# EAGLE design floppy (EAGLE 8.3.1)
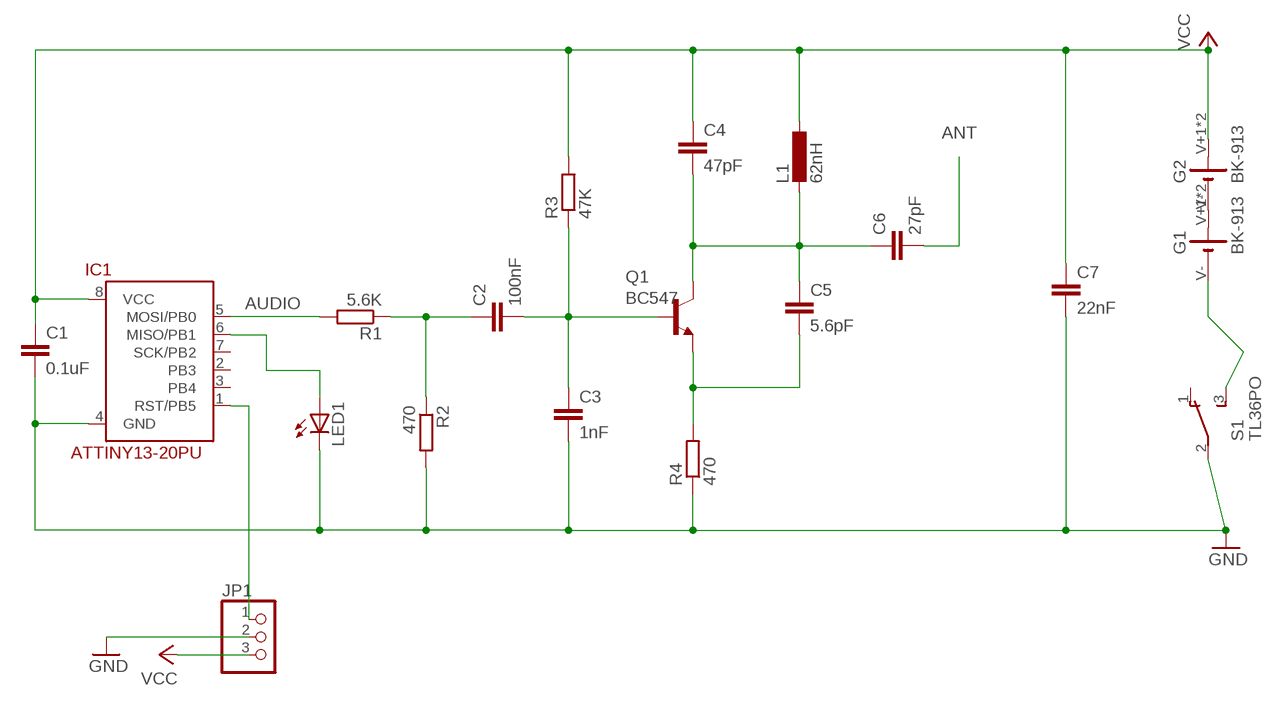
[diagram p0: schematic, sheet 1]

## Parts
C1  0.1uF  C-EU025-025X050  [C025-025X050]
C2  100nF  C-EU025-025X050  [C025-025X050]
C3  1nF  C-EU025-025X050  [C025-025X050]
C4  47pF  C-EU025-025X050  [C025-025X050]
C5  5.6pF  C-EU025-025X050  [C025-025X050]
C6  27pF  C-EU025-025X050  [C025-025X050]
C7  22nF  C-EU025-025X050  [C025-025X050]
G1  BK-913  [BK-913]
G2  BK-913  [BK-913]
IC1  ATTINY13-20PU  [DIL08]
JP1  PINHD-1X3  [1X03]
L1  62nH  L-EU0207/7  [0207/7]
LED1  LED5MM  [LED5MM]
Q1  BC547  [TO92]
R1  5.6K  R-EU_0207/7  [0207/7]
R2  470  R-EU_0207/7  [0207/7]
R3  47K  R-EU_0207/7  [0207/7]
R4  470  R-EU_0207/7  [0207/7]
S1  TL36PO  [TL3XPO]

## Nets
ANT: C6.2
AUDIO: C2.1 R1.1 R2.1
DW: IC1.1(RST/PB5) JP1.1
GND: C1.2 C3.2 C7.2 IC1.4(GND) JP1.2 LED1.K(C) R2.2 R4.1 S1.2(P)
N$3: G1.V- S1.3(S)
N$4: IC1.5(MOSI/PB0) R1.2
N$5: IC1.6(MISO/PB1) LED1.A
N$6: C4.2 C5.1 C6.1 L1.2 Q1.3(C)
N$7: C5.2 Q1.1(E) R4.2
N$8: C2.2 C3.1 Q1.2(B) R3.1
N$9: G1.V+1(V+) G1.V+2(V+) G2.V-
VCC: C1.1 C4.1 C7.1 G2.V+1(V+) G2.V+2(V+) IC1.8(VCC) JP1.3 L1.1 R3.2
Unconnected: IC1.2(PB3) IC1.3(PB4) IC1.7(SCK/PB2) S1.1(O)

## Library data of the parts
C1-C7 = rcl:C-EU: CAPACITOR, European symbol
G1 G2 = local:BK-913: BK-913 CR2032 BATTERY RETAINER
IC1 = attiny13:ATTINY13-20*
JP1 = pinhead:PINHD-1X3: PIN HEADER
L1 = rcl:L-EU: INDUCTOR, European symbol
LED1 = led:LED: LED OSRAM: - CHIPLED LG R971, LG N971, LY N971, LG Q971, LY Q971, LO R971, LY R971 LH N974, LH R974 LS Q976, LO Q976, LY Q976 LO Q996 - Hyper CHIPLED LW Q18S LB Q993, LB Q99A, LB R99A - SideLED LS A670, LO A670, LY A670, LG A670, LP A670 LB A673, LV A673, LT A673, LW A673 LH A674 LY A675 LS A676, LA A676, LO A676, LY A676, LW A676 LS A679, LY A679, LG A679 - Hyper Micro SIDELED® LS Y876, LA Y876, LO Y876, LY Y876 LT Y87S - SmartLED LW L88C, LW L88S LB L89C, LB L89S, LG L890 LS L89K, LO L89K, LY L89K LS L896, LA L896, LO L896, LY L896 - TOPLED LS T670, LO T670, LY T670, LG T670, LP T670 LSG T670, LSP T670, LSY T670, LOP T670, LYG T670 LG T671, LOG T671, LSG T671 LB T673, LV T673, LT T673, LW T673 LH T674 LS T676, LA T676, LO T676, LY T676, LB T676, LH T676, LSB T676, LW T676 LB T67C, LV T67C, LT T67C, LS T67K, LO T67K, LY T67K, LW E67C LS E67B, LA E67B, LO E67B, LY E67B, LB E67C, LV E67C, LT E67C LW T67C LS T679, LY T679, LG T679 LS T770, LO T770, LY T770, LG T770, LP T770 LB T773, LV T773, LT T773, LW T773 LH T774 LS E675, LA E675, LY E675, LS T675 LS T776, LA T776, LO T776, LY T776, LB T776 LHGB T686 LT T68C, LB T68C - Hyper Mini TOPLED® LB M676 - Mini TOPLED Santana® LG M470 LS M47K, LO M47K, LY M47K Source: http://www.osram.convergy.de LUXEON: - LUMILED® LXK2-PW12-R00, LXK2-PW12-S00, LXK2-PW14-U00, LXK2-PW14-V00 LXK2-PM12-R00, LXK2-PM12-S00, LXK2-PM14-U00 LXK2-PE12-Q00, LXK2-PE12-R00, LXK2-PE12-S00, LXK2-PE14-T00, LXK2-PE14-U00 LXK2-PB12-K00, LXK2-PB12-L00, LXK2-PB12-M00, LXK2-PB14-N00, LXK2-PB14-P00, LXK2-PB14-Q00 LXK2-PR12-L00, LXK2-PR12-M00, LXK2-PR14-Q00, LXK2-PR14-R00 LXK2-PD12-Q00, LXK2-PD12-R00, LXK2-PD12-S00 LXK2-PH12-R00, LXK2-PH12-S00 LXK2-PL12-P00, LXK2-PL12-Q00, LXK2-PL12-R00 Source: www.luxeon.com KINGBRIGHT: KA-3528ASYC Source: www.kingbright.com
Q1 = transistor-npn:BC547*: NPN Transistor
R1-R4 = rcl:R-EU_: RESISTOR, European symbol
S1 = switch:TL36PO: TINY SWITCH ON - ON Source: http://www2.produktinfo.conrad.com/datenblaetter/700000-724999/705152-da-01-de-Subminiaturschalter_TL_36YO.pdf

## Board
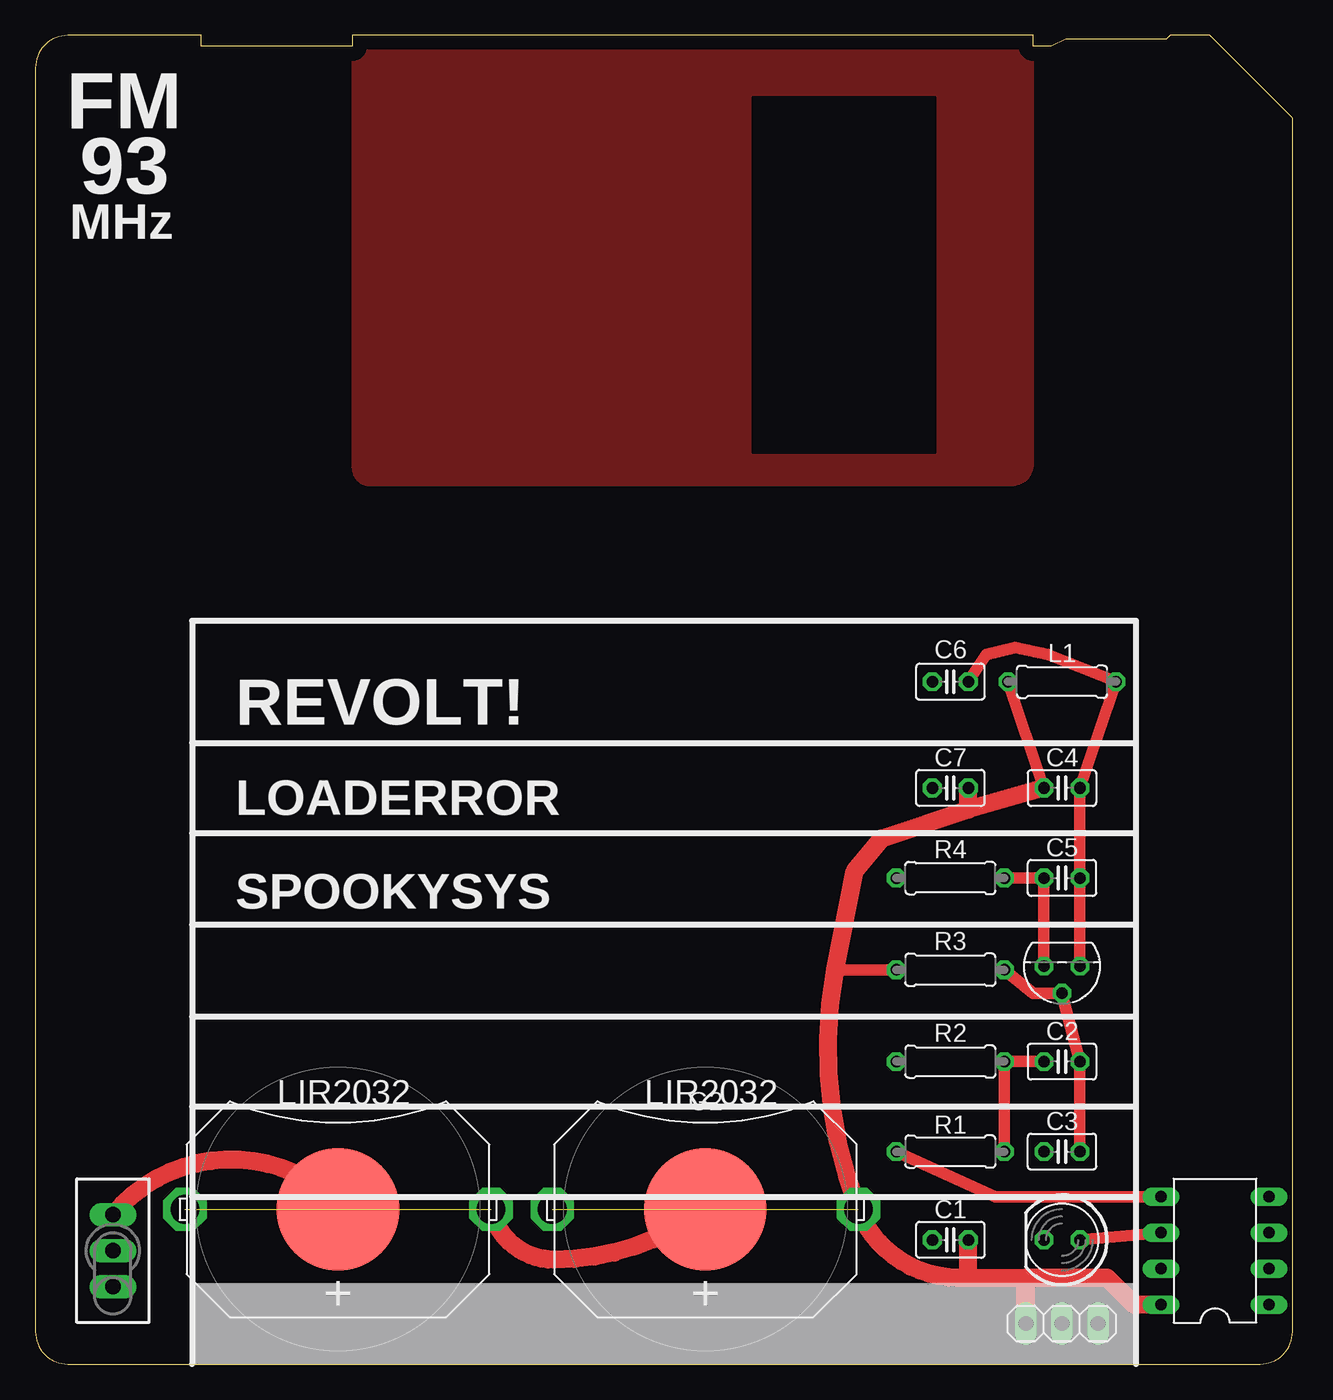
[diagram p1: board, top side]
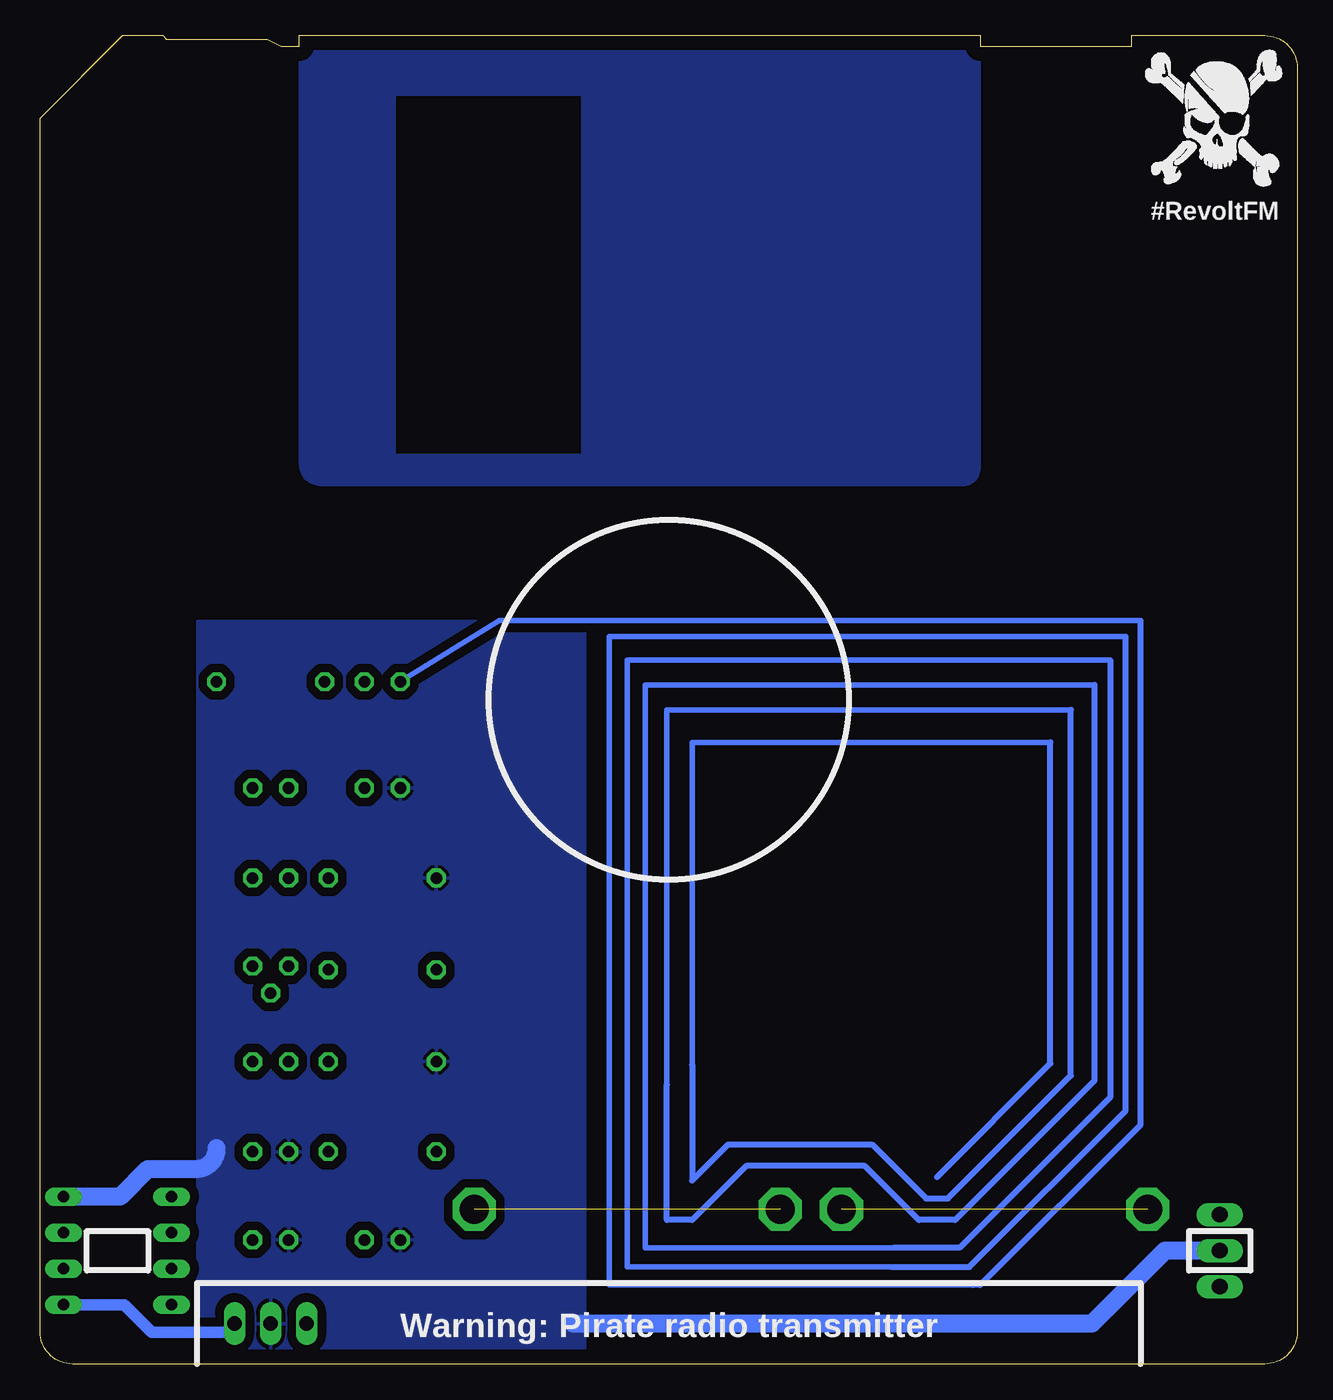
[diagram p2: board, bottom side, seen from below]

Size 88.65 x 93.73 mm. Coordinates in mm from the lower left corner, seen from the top.
Outline: 2.29,0 86.36,0 arc90 88.65,2.29 88.65,87.88 82.8,93.73 80.01,93.73 79.76,93.47 72.64,93.47 71.63,92.96 70.36,92.96 70.36,93.73 22.35,93.73 22.35,92.96 11.68,92.96 11.68,93.73 2.29,93.73 arc90 0,91.44 0,2.29 arc90 2.29,0
Copper layers (1*16): Top 0.035mm / dielectric 1.5mm / Bottom 0.035mm
Design rules "default": minimum track width 6mil, minimum drill 0.35mm, track to track 6mil, track to pad 6mil, pad to pad 6mil, via to via 6mil, smd to smd 6mil, copper to edge 40mil, drill to drill 6mil, minimum pad ring 10mil, minimum via ring 8mil, stop-mask expansion 4mil, vias tented up to drill 0mil, thermal gap 10mil

### Footprints (pad centres in the part's own frame; a part is rotated, then mirrored left to right if it is on the bottom)
C025-025X050 = drill 0.813 octagon: 1 -1.27,0; 2 1.27,0
BK-913 = drill 2.032 octagon: V+1 -10.795,0; V+2 10.795,0 | smd 8.636 x 8.636: V- 0,0
DIL08 = drill 0.813 long: 1 -3.81,-3.81; 2 -1.27,-3.81; 3 1.27,-3.81; 4 3.81,-3.81; 5 3.81,3.81; 6 1.27,3.81; 7 -1.27,3.81; 8 -3.81,3.81
1X03 = drill 1.016 long: 1 -2.54,0; 2 0,0; 3 2.54,0
0207/7 = drill 0.813 octagon: 1 -3.81,0; 2 3.81,0
LED5MM = drill 0.813 octagon: A -1.27,0; K 1.27,0
TO92 = drill 0.813 octagon: 1 1.27,0; 2 0,1.905; 3 -1.27,0
TL3XPO = drill 1.1 pad 1.422 long: 1 -2.54,0; 2 0,0; 3 2.54,0

### Placement (x,y rotation side)
C1  64.52,8.76 180 top
C2  72.39,21.34 0 top
C3  72.39,14.99 180 top
C4  72.39,40.64 0 top
C5  72.39,34.29 180 top
C6  64.52,48.13 180 top
C7  64.52,40.64 180 top
G1  21.34,10.92 0 top
G2  47.24,10.92 0 top
IC1  83.19,8 90 top
JP1  72.39,2.86 180 top
L1  72.39,48.13 0 top
LED1  72.39,8.76 180 top
Q1  72.39,28.07 180 top
R1  64.52,14.99 180 top
R2  64.52,21.34 180 top
R3  64.52,27.81 180 top
R4  64.52,34.29 0 top
S1  5.46,8 90 top

### Tracks (layer width: path | path; a pad name or v marks a point on that pad's centre or on a via)
ANT
  Bottom 0.4: C6.2 56.26,52.45 11.05,52.45 | 22.48,5.59 22.86,5.59 48.51,5.59 48.51,51.31 12.1,51.31 | 28.61,6.85 47.24,6.85 47.24,49.66 13.2,49.66 | 28.44,8.21 45.97,8.21 45.97,47.92 14.3,47.92 | 44.45,19.72 44.45,46.14 15.96,46.14 | 42.67,21.13 42.67,43.86 17.4,43.86
  Bottom 0.406: 11.05,52.45 11.05,16.89 22.35,5.59 22.86,5.59 | 28.61,6.85 23.12,6.85 12.1,17.87 12.1,51.31 | 13.2,49.66 13.2,18.8 23.8,8.21 28.44,8.21 | 14.3,47.92 14.3,19.99 24.13,10.16 26.67,10.16 30.48,13.97 38.86,13.97 42.67,10.16 44.45,10.16 44.45,19.72 | 42.67,21.13 42.67,12.95 40.13,15.49 29.97,15.49 26.16,11.68 24.64,11.68 15.96,20.36 15.96,46.14 | 25.4,13.21 17.4,21.21 17.4,43.86
AUDIO
  Top 0.813: R1.1 R2.1 C2.1
DW
  Bottom 0.813: JP1.1 75.55,2.23 80.77,2.23 82.73,4.19 IC1.1
GND
  Bottom 1.27: 51.05,2.86 14.48,2.86 9.34,8 S1.2 | 76.2,15.24 arc90 77.6,13.77 81.05,13.77 83.01,11.81 IC1.4
  pour Bottom (isolate 0.61): 50.16,52.45 50.16,0 77.6,0 77.6,52.45
N$1
  pour Top (no thermals): 22.35,93.73 22.35,63.25 arc100 23.88,61.98 68.83,61.98 arc90 70.36,63.5 70.36,93.73
N$2
  cutout Top (no thermals): 50.55,89.41 63.5,89.41 63.5,64.26 50.55,64.26
N$3
  Top 1.27: G1.V- 18.29,13.46 arc74 S1.3
N$4
  Top 0.813: R1.2 67.69,11.81 IC1.5
N$5
  Top 0.813: IC1.6 LED1.A
N$6
  Top 0.813: Q1.3 C5.1 C4.2 L1.2 71.37,50.04 69.09,50.55 67.06,50.04 C6.1
N$7
  Top 0.813: Q1.1 C5.2 R4.2
N$8
  Top 0.813: C3.1 C2.2 Q1.2 70.36,26.16 R3.1
N$9  (1 unrouted)
  Top 1.27: G2.V- arc-37 36.58,7.37 arc-77 G1.V+2
N$10
  pour Bottom (no thermals): 22.35,93.73 22.35,63.25 arc100 23.88,61.98 68.83,61.98 arc90 70.36,63.5 70.36,93.73
N$11
  cutout Bottom (no thermals): 50.55,89.41 63.5,89.41 63.5,64.26 50.55,64.26
VCC  (1 unrouted)
  Top 0.813: L1.1 C4.1 | R3.2 56.39,27.81
  Top 1.27: 65.79,39.12 59.69,37.08 57.78,34.8 56.39,27.81 arc32 G2.V+2 arc73 65.79,6.1 | 65.79,39.12 C7.1 | C4.1 65.79,39.12 | 65.79,6.1 C1.1 | 65.79,6.1 69.85,6.1 | 69.85,6.1 75.56,6.1 77.47,4.19 IC1.8 | JP1.3 69.85,6.1

### Text on the board
tPlace: FM | 93 | MHz | REVOLT! | LOADERROR | SPOOKYSYS
bPlace: #RevoltFM | Warning: Pirate radio transmitter
tNames: LIR2032 | LIR2032